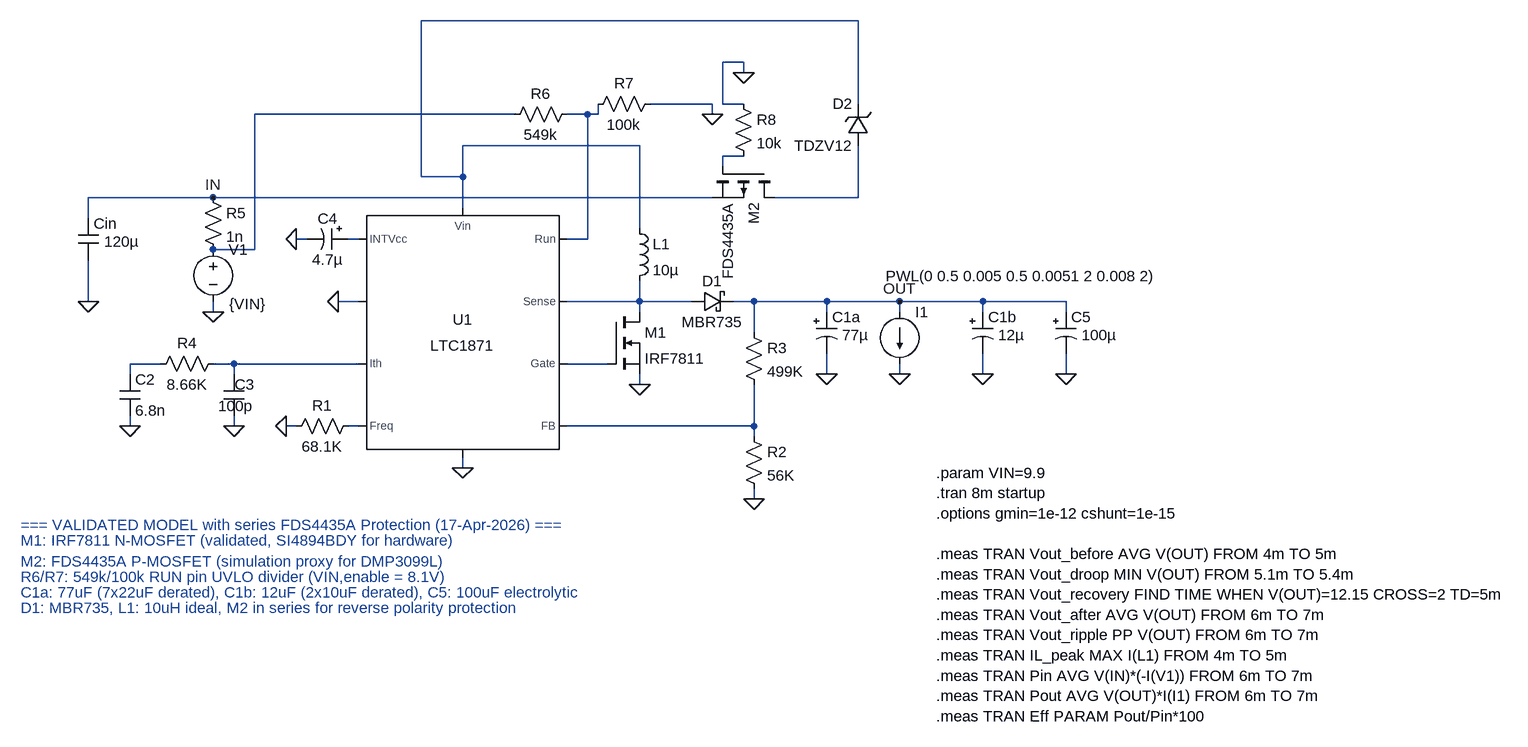
[diagram p0: schematic LTC1871_Validated_Final_Fixed.asc]
LTC1871_Validated_Final_Fixed.asc, the LTspice schematic file:
Version 4.1
SHEET 1 5664 2640
WIRE 2240 896 1568 896
WIRE 2064 960 2032 960
WIRE 2064 976 2064 960
WIRE 2016 1024 1920 1024
WIRE 2032 1024 2032 960
WIRE 2064 1024 2032 1024
WIRE 2240 1024 2240 896
WIRE 1712 1040 1312 1040
WIRE 1824 1040 1792 1040
WIRE 1840 1040 1840 1024
WIRE 1840 1040 1824 1040
WIRE 2016 1040 2016 1024
WIRE 1904 1088 1632 1088
WIRE 2064 1104 2032 1104
WIRE 2032 1120 2032 1104
WIRE 1568 1136 1568 896
WIRE 1632 1136 1632 1088
WIRE 1632 1136 1568 1136
WIRE 1248 1168 1056 1168
WIRE 2016 1168 1248 1168
WIRE 2240 1168 2240 1088
WIRE 2240 1168 2112 1168
WIRE 1632 1184 1632 1136
WIRE 1056 1200 1056 1168
WIRE 1904 1216 1904 1088
WIRE 1392 1232 1376 1232
WIRE 1472 1232 1456 1232
WIRE 1824 1232 1824 1040
WIRE 1824 1232 1792 1232
WIRE 1312 1248 1312 1040
WIRE 1312 1248 1248 1248
WIRE 1056 1328 1056 1264
WIRE 1472 1328 1440 1328
WIRE 1904 1328 1904 1296
WIRE 1904 1328 1792 1328
WIRE 1984 1328 1904 1328
WIRE 2080 1328 2048 1328
WIRE 2192 1328 2080 1328
WIRE 2304 1328 2192 1328
WIRE 2432 1328 2304 1328
WIRE 2560 1328 2432 1328
WIRE 1248 1344 1248 1328
WIRE 1904 1344 1904 1328
WIRE 2192 1344 2192 1328
WIRE 2304 1344 2304 1328
WIRE 2432 1344 2432 1328
WIRE 2560 1344 2560 1328
WIRE 2080 1376 2080 1328
WIRE 1168 1424 1120 1424
WIRE 1280 1424 1248 1424
WIRE 1472 1424 1280 1424
WIRE 1856 1424 1792 1424
WIRE 1120 1440 1120 1424
WIRE 1280 1440 1280 1424
WIRE 2192 1440 2192 1408
WIRE 2304 1440 2304 1424
WIRE 2432 1440 2432 1408
WIRE 2560 1440 2560 1408
WIRE 1904 1456 1904 1440
WIRE 1120 1520 1120 1504
WIRE 1280 1520 1280 1504
WIRE 1376 1520 1360 1520
WIRE 1472 1520 1456 1520
WIRE 2080 1520 2080 1456
WIRE 2080 1520 1792 1520
WIRE 2080 1536 2080 1520
WIRE 1632 1584 1632 1568
WIRE 2080 1632 2080 1616
FLAG 1056 1328 0
FLAG 1904 1456 0
FLAG 1360 1520 0
FLAG 2080 1632 0
FLAG 1632 1584 0
FLAG 2192 1440 0
FLAG 1280 1520 0
FLAG 1120 1520 0
FLAG 2304 1440 0
FLAG 2432 1440 0
FLAG 1248 1344 0
FLAG 1440 1328 0
FLAG 1376 1232 0
FLAG 2304 1328 OUT
FLAG 1248 1168 IN
FLAG 2016 1040 0
FLAG 2064 976 0
FLAG 2560 1440 0
SYMBOL cap 1040 1200 R0
WINDOW 3 40 36 Left 2
SYMATTR Value 120µ
SYMATTR InstName Cin
SYMBOL RES 1472 1504 R90
WINDOW 0 0 56 VBottom 2
WINDOW 3 32 56 VTop 2
SYMATTR InstName R1
SYMATTR Value 68.1K
SYMBOL res 2064 1520 R0
SYMATTR InstName R2
SYMATTR Value 56K
SYMBOL res 2064 1360 R0
SYMATTR InstName R3
SYMATTR Value 499K
SYMBOL ind 1888 1200 R0
SYMATTR InstName L1
SYMATTR Value 10µ
SYMBOL schottky 1984 1344 R270
WINDOW 0 32 32 VTop 2
WINDOW 3 0 32 VBottom 2
SYMATTR InstName D1
SYMATTR Value MBR735
SYMBOL polcap 2176 1344 R0
WINDOW 40 27 64 Left 2
WINDOW 3 40 36 Left 2
SYMATTR Value 77µ
SYMATTR InstName C1a
SYMBOL polcap 2416 1344 R0
WINDOW 40 27 64 Left 2
WINDOW 3 40 36 Left 2
SYMATTR Value 12µ
SYMATTR InstName C1b
SYMBOL res 1264 1408 R90
WINDOW 0 0 56 VBottom 2
WINDOW 3 32 56 VTop 2
SYMATTR InstName R4
SYMATTR Value 8.66K
SYMBOL cap 1104 1440 R0
SYMATTR InstName C2
SYMATTR Value 6.8n
SYMBOL cap 1264 1440 R0
WINDOW 0 17 16 Left 2
WINDOW 3 -8 49 Left 2
SYMATTR InstName C3
SYMATTR Value 100p
SYMBOL POWERPRODUCTS\\LTC1871 1632 1376 R0
SYMATTR InstName U1
SYMBOL VOLTAGE 1248 1232 R0
WINDOW 123 0 0 Left 0
WINDOW 39 -11 -34 Left 0
WINDOW 3 25 100 Left 2
SYMATTR Value {VIN}
SYMATTR InstName V1
SYMBOL polcap 1456 1216 R90
WINDOW 0 0 32 VBottom 2
WINDOW 3 32 32 VTop 2
SYMATTR InstName C4
SYMATTR Value 4.7µ
SYMBOL current 2304 1344 R0
WINDOW 123 0 0 Left 0
WINDOW 39 0 0 Left 0
WINDOW 3 -21 -55 Left 2
SYMATTR Value PWL(0 0.5 0.005 0.5 0.0051 2 0.008 2)
SYMATTR InstName I1
SYMBOL res 1232 1152 R0
SYMATTR InstName R5
SYMATTR Value 1n
SYMBOL nmos 1856 1344 R0
SYMATTR InstName M1
SYMATTR Value IRF7811
SYMBOL res 1808 1024 R90
WINDOW 0 0 56 VBottom 2
WINDOW 3 32 56 VTop 2
SYMATTR InstName R6
SYMATTR Value 549k
SYMBOL res 1936 1008 R90
WINDOW 0 0 56 VBottom 2
WINDOW 3 32 56 VTop 2
SYMATTR InstName R7
SYMATTR Value 100k
SYMBOL pmos 2112 1120 R90
SYMATTR InstName M2
SYMATTR Value FDS4435A
SYMBOL res 2048 1008 R0
SYMATTR InstName R8
SYMATTR Value 10k
SYMBOL zener 2256 1088 R180
WINDOW 0 24 64 Left 2
WINDOW 3 24 0 Left 2
SYMATTR InstName D2
SYMATTR Value TDZV12
SYMBOL polcap 2544 1344 R0
WINDOW 40 27 64 Left 2
WINDOW 3 40 36 Left 2
SYMATTR Value 100µ
SYMATTR SpiceLine Rser=0.1
SYMATTR InstName C5
TEXT 2360 1592 Left 2 !.param VIN=9.9\n.tran 8m startup\n.options gmin=1e-12 cshunt=1e-15\n \n.meas TRAN Vout_before AVG V(OUT) FROM 4m TO 5m\n.meas TRAN Vout_droop MIN V(OUT) FROM 5.1m TO 5.4m\n.meas TRAN Vout_recovery FIND TIME WHEN V(OUT)=12.15 CROSS=2 TD=5m\n.meas TRAN Vout_after AVG V(OUT) FROM 6m TO 7m\n.meas TRAN Vout_ripple PP V(OUT) FROM 6m TO 7m\n.meas TRAN IL_peak MAX I(L1) FROM 4m TO 5m\n.meas TRAN Pin AVG V(IN)*(-I(V1)) FROM 6m TO 7m\n.meas TRAN Pout AVG V(OUT)*I(I1) FROM 6m TO 7m\n.meas TRAN Eff PARAM Pout/Pin*100
TEXT 952 1672 Left 2 ;=== VALIDATED MODEL with series FDS4435A Protection (17-Apr-2026) ===
TEXT 952 1696 Left 2 ;M1: IRF7811 N-MOSFET (validated, SI4894BDY for hardware)
TEXT 952 1728 Left 2 ;M2: FDS4435A P-MOSFET (simulation proxy for DMP3099L)
TEXT 952 1752 Left 2 ;R6/R7: 549k/100k RUN pin UVLO divider (VIN,enable = 8.1V)
TEXT 952 1776 Left 2 ;C1a: 77uF (7x22uF derated), C1b: 12uF (2x10uF derated), C5: 100uF electrolytic
TEXT 952 1800 Left 2 ;D1: MBR735, L1: 10uH ideal, M2 in series for reverse polarity protection

The netlist it stands for:
* LTC1871_Validated_Final_Fixed.asc
Cin IN 0 120µ
R1 N011 0 68.1K
R2 N012 0 56K
R3 OUT N012 499K
L1 N001 N007 10µ
D1 N007 OUT MBR735
C1a OUT 0 77µ
C1b OUT 0 12µ
R4 N009 N008 8.66K
C2 N008 0 6.8n
C3 N009 0 100p
X§U1 N003 N009 N012 N011 0 0 N010 N006 N001 N007 LTC1871  ; pins Run Ith FB Freq ? ? Gate INTVcc Vin Sense
V1 N002 0 {VIN}
C4 N006 0 4.7µ
I1 OUT 0 PWL(0 0.5 0.005 0.5 0.0051 2 0.008 2)
R5 IN N002 1n
M1 N007 N010 0 0 IRF7811
R6 N003 N002 549k
R7 0 N003 100k
M2 N005 N004 IN IN FDS4435A
R8 0 N004 10k
D2 N005 N001 TDZV12
C5 OUT 0 100µ Rser=0.1
.model D D
.lib standard.dio
.model NMOS NMOS
.model PMOS PMOS
.lib standard.mos
.param VIN=9.9
.tran 8m startup
.options gmin=1e-12 cshunt=1e-15
.meas TRAN Vout_before AVG V(OUT) FROM 4m TO 5m
.meas TRAN Vout_droop MIN V(OUT) FROM 5.1m TO 5.4m
.meas TRAN Vout_recovery FIND TIME WHEN V(OUT)=12.15 CROSS=2 TD=5m
.meas TRAN Vout_after AVG V(OUT) FROM 6m TO 7m
.meas TRAN Vout_ripple PP V(OUT) FROM 6m TO 7m
.meas TRAN IL_peak MAX I(L1) FROM 4m TO 5m
.meas TRAN Pin AVG V(IN)*(-I(V1)) FROM 6m TO 7m
.meas TRAN Pout AVG V(OUT)*I(I1) FROM 6m TO 7m
.meas TRAN Eff PARAM Pout/Pin*100
* === VALIDATED MODEL with series FDS4435A Protection (17-Apr-2026) ===
* M1: IRF7811 N-MOSFET (validated, SI4894BDY for hardware)
* M2: FDS4435A P-MOSFET (simulation proxy for DMP3099L)
* R6/R7: 549k/100k RUN pin UVLO divider (VIN,enable = 8.1V)
* C1a: 77uF (7x22uF derated), C1b: 12uF (2x10uF derated), C5: 100uF electrolytic
* D1: MBR735, L1: 10uH ideal, M2 in series for reverse polarity protection
.lib LTC1871.sub
.backanno
.end